# Altium schematic sheet AY Amp.SchDoc
size A3; SheetNumber: 3; SheetTotal: 15
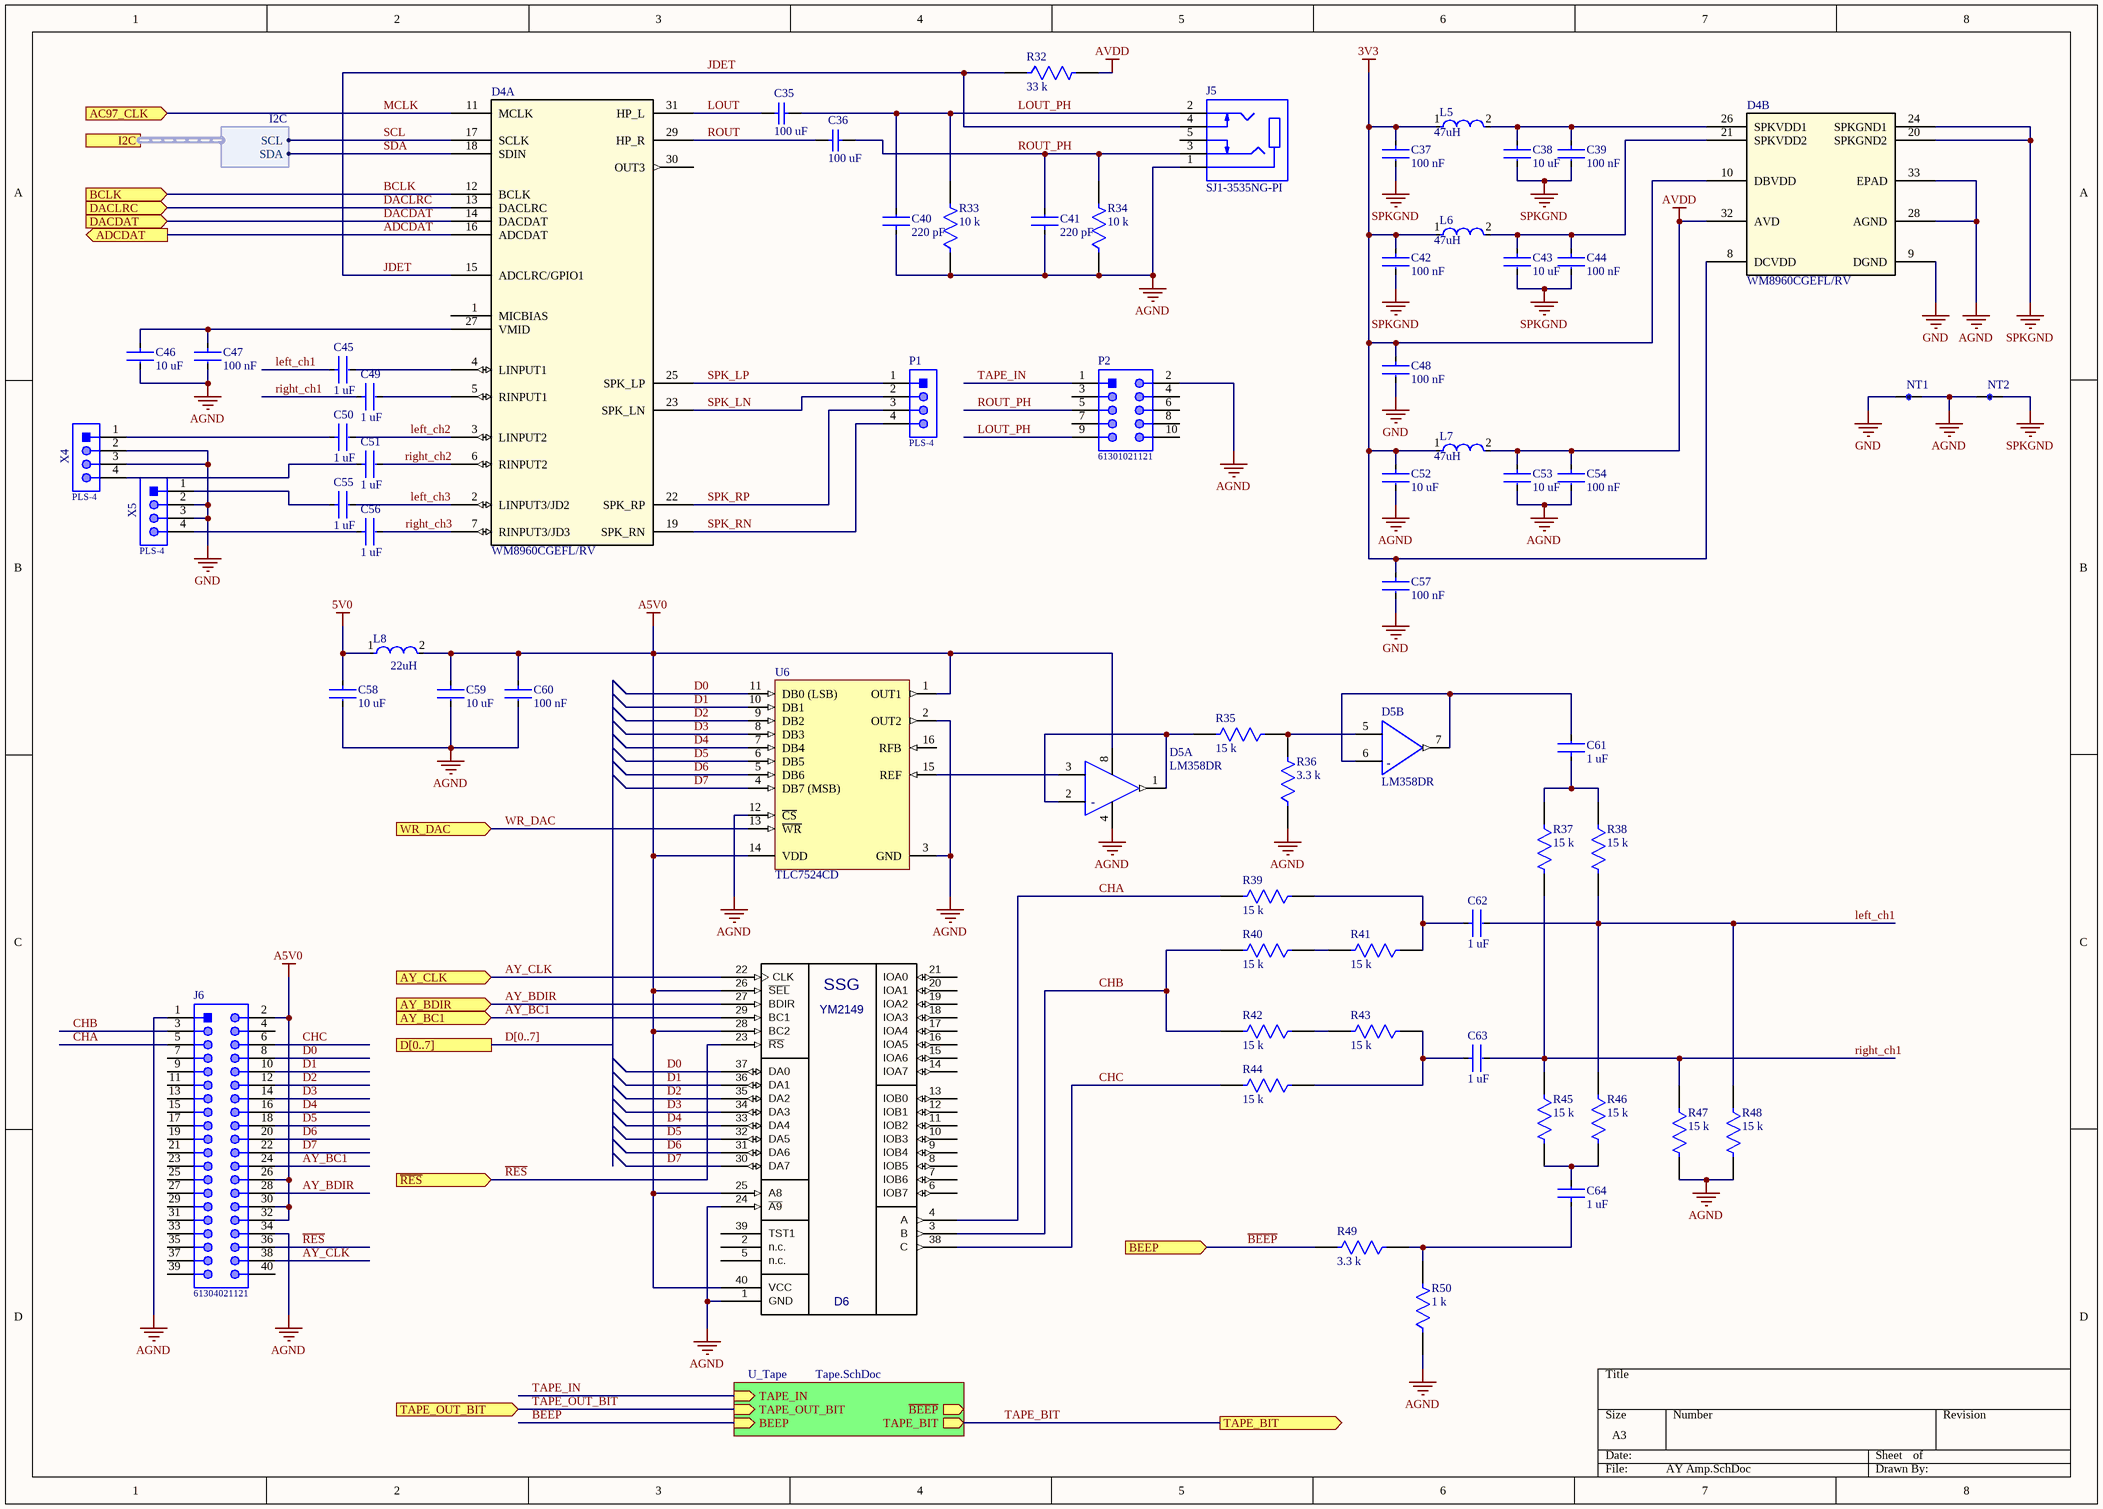
[diagram p0: AY Amp.SchDoc]

## Parts
C35  Capacitance: 100 uF  [CAPC3216X190X55ML30T25]  (hidden comment: CC1206-100uF)
C36  Capacitance: 100 uF  [CAPC3216X190X55ML30T25]  (hidden comment: CC1206-100uF)
C37  Capacitance: 100 nF  [CC0805]  (hidden comment: CC0805-1.5pF)
C38  Capacitance: 10 uF  [CC0805]  (hidden comment: CC0805-1.5pF)
C39  Capacitance: 100 nF  [CC0805]  (hidden comment: CC0805-1.5pF)
C40  Capacitance: 220 pF  [CC0805]  (hidden comment: CC0805-1.5pF)
C41  Capacitance: 220 pF  [CC0805]  (hidden comment: CC0805-1.5pF)
C42  Capacitance: 100 nF  [CC0805]  (hidden comment: CC0805-1.5pF)
C43  Capacitance: 10 uF  [CC0805]  (hidden comment: CC0805-1.5pF)
C44  Capacitance: 100 nF  [CC0805]  (hidden comment: CC0805-1.5pF)
C45  Capacitance: 1 uF  [CC0805]  (hidden comment: CC0805-1.5pF)
C46  Capacitance: 10 uF  [CC0805]  (hidden comment: CC0805-1.5pF)
C47  Capacitance: 100 nF  [CC0805]  (hidden comment: CC0805-1.5pF)
C48  Capacitance: 100 nF  [CC0805]  (hidden comment: CC0805-1.5pF)
C49  Capacitance: 1 uF  [CC0805]  (hidden comment: CC0805-1.5pF)
C50  Capacitance: 1 uF  [CC0805]  (hidden comment: CC0805-1.5pF)
C51  Capacitance: 1 uF  [CC0805]  (hidden comment: CC0805-1.5pF)
C52  Capacitance: 10 uF  [CC0805]  (hidden comment: CC0805-1.5pF)
C53  Capacitance: 10 uF  [CC0805]  (hidden comment: CC0805-1.5pF)
C54  Capacitance: 100 nF  [CC0805]  (hidden comment: CC0805-1.5pF)
C55  Capacitance: 1 uF  [CC0805]  (hidden comment: CC0805-1.5pF)
C56  Capacitance: 1 uF  [CC0805]  (hidden comment: CC0805-1.5pF)
C57  Capacitance: 100 nF  [CC0805]  (hidden comment: CC0805-1.5pF)
C58  Capacitance: 10 uF  [CC0805]  (hidden comment: CC0805-1.5pF)
C59  Capacitance: 10 uF  [CC0805]  (hidden comment: CC0805-1.5pF)
C60  Capacitance: 100 nF  [CC0805]  (hidden comment: CC0805-1.5pF)
C61  Capacitance: 1 uF  [CC0805]  (hidden comment: CC0805-1.5pF)
C62  Capacitance: 1 uF  [CC0805]  (hidden comment: CC0805-1.5pF)
C63  Capacitance: 1 uF  [CC0805]  (hidden comment: CC0805-1.5pF)
C64  Capacitance: 1 uF  [CC0805]  (hidden comment: CC0805-1.5pF)
D4  WM8960CGEFL/RV  [QFN50P500X500X90_HS-33M]  (parts A,B of 2)
D5  LM358DR  [FP-D0008A-MFG]  (parts A,B of 2)
D6  YM2149  [DIP40]
J5  SJ1-3535NG-PI  [CUI_SJ1-3535NG-PI]
J6  61304021121  [61304021121]
L5  Inductance: 47uH  [FP-NR6028-MFG]  (hidden comment: NR6028T470M)
L6  Inductance: 47uH  [FP-NR6028-MFG]  (hidden comment: NR6028T470M)
L7  Inductance: 47uH  [FP-NR6028-MFG]  (hidden comment: NR6028T470M)
L8  Inductance: 22uH  [FP-LQH43CN_03-MFG]  (hidden comment: LQH43CN220K03L)
NT1  net_tie  [NET_TIE]  (value not drawn)  (net tie, no BOM)
NT2  net_tie  [NET_TIE]  (value not drawn)  (net tie, no BOM)
P1  PLS-4  [61300411121]
P2  61301021121  [61301021121]
R32  Resistance: 33 k  [CR0805]  (hidden comment: CR0805-51)
R33  Resistance: 10 k  [CR0805]  (hidden comment: CR0805-51)
R34  Resistance: 10 k  [CR0805]  (hidden comment: CR0805-51)
R35  Resistance: 15 k  [CR0805]  (hidden comment: CR0805-51)
R36  Resistance: 3.3 k  [CR0805]  (hidden comment: CR0805-51)
R37  Resistance: 15 k  [CR0805]  (hidden comment: CR0805-51)
R38  Resistance: 15 k  [CR0805]  (hidden comment: CR0805-51)
R39  Resistance: 15 k  [CR0805]  (hidden comment: CR0805-51)
R40  Resistance: 15 k  [CR0805]  (hidden comment: CR0805-51)
R41  Resistance: 15 k  [CR0805]  (hidden comment: CR0805-51)
R42  Resistance: 15 k  [CR0805]  (hidden comment: CR0805-51)
R43  Resistance: 15 k  [CR0805]  (hidden comment: CR0805-51)
R44  Resistance: 15 k  [CR0805]  (hidden comment: CR0805-51)
R45  Resistance: 15 k  [CR0805]  (hidden comment: CR0805-51)
R46  Resistance: 15 k  [CR0805]  (hidden comment: CR0805-51)
R47  Resistance: 15 k  [CR0805]  (hidden comment: CR0805-51)
R48  Resistance: 15 k  [CR0805]  (hidden comment: CR0805-51)
R49  Resistance: 3.3 k  [CR0805]  (hidden comment: CR0805-51)
R50  Resistance: 1 k  [CR0805]  (hidden comment: CR0805-51)
U6  TLC7524CD  [SO16W]
X4  PLS-4  [61300411121]
X5  PLS-4  [61300411121]

## Sub-sheets
U_Tape = Tape.SchDoc: BEEP (in), TAPE_BIT (out), ~{BEEP} (out), TAPE_OUT_BIT (in), TAPE_IN (in)

## Ports
AC97_CLK (in), ADCDAT (out), AY_BC1 (in), AY_BDIR (in), AY_CLK (in), BCLK (in), BEEP (in), D[0..7], DACDAT (in), DACLRC (in), I2C (harness I2C), TAPE_BIT (out), TAPE_OUT_BIT (in), WR_DAC (in), ~{RES} (in)

## Harnesses
I2C: SDA, SCL

## Nets
3V3: C37.1 C42.1 C48.1 C52.1 C57.1 D4.8(DCVDD) D4.10(DBVDD) L5.1 L6.1 L7.1
5V0: C58.1 L8.1
A5V0: C59.1 C60.1 D5.8(V+) D6.25(A8) D6.26(~{SEL}) D6.28(BC2) D6.40(VCC) J6.2 J6.26 J6.30 J6.32 L8.2 U6.1(OUT1) U6.14(VDD)
AGND: C40.1 C41.1 C46.2 C47.2 C52.2 C53.2 C54.2 C58.2 C59.2 C60.2 D4.28(AGND) D4.33(EPAD) D5.4(V-) D6.1(GND) D6.24(~{A9}) J5.1 J6.1 J6.34 NT1.2 NT2.1 P2.2 R33.1 R34.1 R36.1 R47.2 R48.2 R50.1 U6.2(OUT2) U6.3(GND) U6.12(~{CS})
AVDD: C53.1 C54.1 D4.32(AVD) L7.2 R32.2
GND: C48.2 C57.2 D4.9(DGND) NT1.1 X4.2 X4.3 X5.2 X5.3
SPKGND: C37.2 C38.2 C39.2 C42.2 C43.2 C44.2 D4.20(SPKGND2) D4.24(SPKGND1) NT2.2
ADCDAT: D4.16(ADCDAT) ; port ADCDAT
AY_BC1: D6.29(BC1) J6.24 ; port AY_BC1
AY_BDIR: D6.27(BDIR) J6.28 ; port AY_BDIR
AY_CLK: D6.22(CLK) J6.38 ; port AY_CLK
~{BEEP}: R49.2 ; port BEEP
BCLK: D4.12(BCLK) ; port BCLK
BEEP: sheet U_Tape/BEEP
CHA: D6.4(A) J6.5 R39.2
CHB: D6.3(B) J6.3 R40.2 R42.2
CHC: D6.38(C) J6.6 R44.2
D0: D6.37(DA0) J6.8 U6.11(DB0_(LSB))
D1: D6.36(DA1) J6.10 U6.10(DB1)
D2: D6.35(DA2) J6.12 U6.9(DB2)
D3: D6.34(DA3) J6.14 U6.8(DB3)
D4: D6.33(DA4) J6.16 U6.7(DB4)
D5: D6.32(DA5) J6.18 U6.6(DB5)
D6: D6.31(DA6) J6.20 U6.5(DB6)
D7: D6.30(DA7) J6.22 U6.4(DB7_(MSB))
DACDAT: D4.14(DACDAT) ; port DACDAT
DACLRC: D4.13(DACLRC) ; port DACLRC
JDET: D4.15(ADCLRC/GPIO1) J5.4 R32.1
left_ch1: C45.1 C62.2 R38.2 R46.1 R48.1
left_ch2: C50.2 D4.3(LINPUT2)
left_ch3: C55.2 D4.2(LINPUT3/JD2)
LOUT: C35.1 D4.31(HP_L)
LOUT_PH: C35.2 C40.2 J5.2 P2.9 R33.2
MCLK: D4.11(MCLK) ; port AC97_CLK
~{RES}: D6.23(~{RS}) J6.36 ; port ~{RES}
right_ch1: C49.1 C63.2 R37.2 R45.1 R47.1
right_ch2: C51.2 D4.6(RINPUT2)
right_ch3: C56.2 D4.7(RINPUT3/JD3)
ROUT: C36.1 D4.29(HP_R)
ROUT_PH: C36.2 C41.2 J5.3 P2.5 R34.2
SCL: D4.17(SCLK) ; port I2C.SCL
SDA: D4.18(SDIN) ; port I2C.SDA
SPK_LN: D4.23(SPK_LN) P1.2
SPK_LP: D4.25(SPK_LP) P1.1
SPK_RN: D4.19(SPK_RN) P1.4
SPK_RP: D4.22(SPK_RP) P1.3
TAPE_BIT: port TAPE_BIT, sheet U_Tape/TAPE_BIT
TAPE_IN: P2.1 ; sheet U_Tape/TAPE_IN
TAPE_OUT_BIT: port TAPE_OUT_BIT, sheet U_Tape/TAPE_OUT_BIT
WR_DAC: U6.13(~{WR}) ; port WR_DAC
NetC38_1: C38.1 C39.1 D4.26(SPKVDD1) L5.2
NetC43_1: C43.1 C44.1 D4.21(SPKVDD2) L6.2
NetC45_2: C45.2 D4.4(LINPUT1)
NetC46_1: C46.1 C47.1 D4.27(VMID)
NetC49_2: C49.2 D4.5(RINPUT1)
NetC50_1: C50.1 X4.1
NetC51_1: C51.1 X4.4
NetC55_1: C55.1 X5.1
NetC56_1: C56.1 X5.4
NetC61_1: C61.1 R37.1 R38.1
NetC61_2: C61.2 D5.6(IN2-) D5.7(2OUT)
NetC62_1: C62.1 R39.1 R41.1
NetC63_1: C63.1 R43.1 R44.1
NetC64_1: C64.1 R49.1 R50.2
NetC64_2: C64.2 R45.2 R46.2
NetD5_1: D5.1(1OUT) D5.2(IN1-) R35.2
NetD5_3: D5.3(IN1+) U6.15(REF)
NetD5_5: D5.5(IN2+) R35.1 R36.2
NetR40_1: R40.1 R41.2
NetR42_1: R42.1 R43.2

Not connected (* = marked no-connect by the designer): D4 1(MICBIAS) 30(OUT3); D6 2(n.c.) 5(n.c.) 6(IOB7) 7(IOB6) 8(IOB5) 9(IOB4) 10(IOB3) 11(IOB2) 12(IOB1) 13(IOB0) 14(IOA7) 15(IOA6) 16(IOA5) 17(IOA4) 18(IOA3) 19(IOA2) 20(IOA1) 21(IOA0) 39(TST1); J5 5; J6 4 7 9 11 13 15 17 19 21 23 25 27 29 31 33 35 37 39 40; P2 3 4 6 7 8 10; U6 16(RFB)

## Buses and harness runs
bus D[0..7] = port D[0..7]

## Notes on the sheet
- (in symbol LM358DR, part A) -
- (in symbol LM358DR, part B) -
- (in symbol YM2149) SSG

## Library data of the parts
C35 C36 = CMP-1662-00011-2: Chip Capacitor, 100 uF, +/- 20%, 6.3 V, -55 to 85 degC, 1206 (3216 Metric), RoHS, Tape and Reel; PartNumber: GRM31CR60J107ME39L; Manufacturer: Murata; value: 100 uF; PackageDescription: 2-Pin Surface Mount Device, Body 3.2 x 1.6 mm; Manufacturer Part Number: GRM31CR60J107ME39L; Case/Package: 1206; Category: Cap
C37-C44 C46-C48 C52-C54 C57-C60 = CC0805: CL21 Series 0805 1.5pF 50V ±0.25pF Tolerance C0G Multilayer Ceramic Chip Capacitor; Manufacturer Part Number: CL21C1R5CBANNNC; Manufacturer: Samsung; Category: Cap; value: 1.5pF; Case/Package: 0805
C45 C49-C51 C55 C56 C61-C64 = CC0805: CL21 Series 0805 1.5pF 50V ±0.25pF Tolerance C0G Multilayer Ceramic Chip Capacitor; Manufacturer: Samsung; Manufacturer Part Number: CL21C1R5CBANNNC; Case/Package: 0805; value: 1.5pF; Category: Cap
D4 = WM8960CGEFL/RV: Stereo CODEC with 1W Stereo Class-D speaker Drivers; value: WM8960CGEFL/RV; Case/Package: QNF-32; Category: IC
D5 = LM358DR: IC OPAMP GP 2 CIRCUIT 8SOIC; Manufacturer: Texas Instruments; Case/Package: SOIC; Number of Pins: 8; Manufacturer Part Number: LM358DR; value: LM358DR; Category: IC
J5 = SJ1-3535NG-PI: 3.5 mm Right-Angle Stereo Jack, 5 pin PCB PCB Mount, Isolated Ground, Pink; MF: {'manufacturer': u'CUI'}; Value: *; MP: SJ1-3535NG-PI; Availability: Unavailable; Price: None; Package: None
J6 = CMP-1502-01135-1: THT Vertical Pin Header WR-PHD, Pitch 2.54 mm, Dual Row, 40 pins; Manufacturer: Wurth Elektronik; Contact Resistance: 20mOhm; Pitch: 2.54mm; Pin Number: 40; Withstanding Voltage: 500VAC; Gender: Male; Rated Current: 3A; Working Voltage: 250VAC; Operating Temperature: -40to105degC; Manufacturer URL: http://www.we-online.de; Orientation: Vertical; Datasheet URL: https://katalog.we-online.de/em/datasheet/6130xx21121.pdf; Package Reference: 61304021121; Row Number: Dual; Part Number: 61304021121; Packaging: Bag; Mounting Technology: THT; Publisher: WurthElektronik
L5-L7 = CMP-14484-001222-1: SMD Power Inductors 47uH ±20% 0.92A 0.39Ω; Current Rating: 920mA; Test Frequency: 100kHz; Core Material: Ferrite; Self Resonant Frequency: 8MHz; Shielding: Shielded; DC Resistance (DCR): 390mR; Saturation Current: 950mA; Termination: SMD/SMT; Package Quantity: 2000; RoHS Compliant: Yes; Halogen Free: Halogen Free; Length: 0.236inch; Series: NR; Tolerance: 20%; Width: 0.236inch; Height - Seated (Max): 0.11inch; Number of Pins: 2; Mount: Surface Mount; Min Operating Temperature: -25°C; RMS Current (Irms): 920mA; Packaging: Tape and Reel; Resistor Type: Wirewound; Case/Package: 2424; Inductance Tolerance: 20%; Max Operating Temperature: 120°C; Max DC Current: 920mA; Height: 2.8mm
L8 = CMP-06042-007646-1: Wire Wound Ferrite Inductor for Power Lines 22μH ±10% 0.6Ω 420mA 1812; Manufacturer: Murata; Frequency: 15MHz; Shielding: Unshielded; Test Frequency: 1MHz; DC Resistance (DCR): 600mR; Mount: Surface Mount; Width: 3.2mm; Depth: 3.4mm; Packaging: Tape and Reel; Case Code (Imperial): 1812; DC Current: 420mA; Weight: 0.004586oz; Core Material: Ferrite; Height: 2.6mm; Number of Pins: 2; Min Operating Temperature: -40°C; Max Operating Temperature: 85°C; REACH SVHC: No SVHC; Self Resonant Frequency: 15MHz; Termination: SMD/SMT; Lead Free: Lead Free; Military Standard: Not; Case Code (Metric): 4532; Length: 4.5mm; Radiation Hardening: No; Inductance Tolerance: 10%; Tolerance: 10%; Height - Seated (Max): 0.11inch; Case/Package: 1812; Max DC Current: 420mA; Package Quantity: 500; Resistor Type: Wirewound; Current Rating: 420mA; Manufacturer Part Number: LQH43CN220K03L
P1 X4 X5 = PLS-4: THT Vertical Pin Header WR-PHD, Pitch 2.54 mm, Single Row, 4 pins; Manufacturer: Wurth Electronics; Pitch: 2.54mm; value: header 4 pin 2.54mm; Manufacturer Part Number: 61300411121; Case/Package: PLS-4; Category: Connector
P2 = CMP-1502-01084-1: THT Vertical Pin Header WR-PHD, Pitch 2.54 mm, Dual Row, 10 pins; Manufacturer: Wurth Elektronik; Working Voltage: 250VAC; Pitch: 2.54mm; Contact Resistance: 20mOhm; Gender: Male; Rated Current: 3A; Withstanding Voltage: 500VAC; Pin Number: 10; Operating Temperature: -40to105degC; Mounting Technology: THT; Publisher: WurthElektronik; Manufacturer URL: http://www.we-online.de; Part Number: 61301021121; Row Number: Dual; Packaging: Bag; Orientation: Vertical; Package Reference: 61301021121; Datasheet URL: https://katalog.we-online.de/em/datasheet/6130xx21121.pdf
R32-R34 R50 = CR0805: 51Ω ±0.5% 0.1W 1/10W Chip Resistor 0805 (2012 Metric) Thin Film; Manufacturer: Susumu; Manufacturer Part Number: RR1220Q-510-D; Number of Terminations: 2; Case/Package: 0805; value: 51Ω; Category: Res; Termination: SMD/SMT; Number of Pins: 2
R35-R49 = CR0805: 51Ω ±0.5% 0.1W 1/10W Chip Resistor 0805 (2012 Metric) Thin Film; Manufacturer Part Number: RR1220Q-510-D; Manufacturer: Susumu; Category: Res; value: 51Ω; Case/Package: 0805; Number of Terminations: 2; Termination: SMD/SMT; Number of Pins: 2
U6 = TLC7524CD: 8-Bit, 0.1 us MDAC, Parallel Input, Fast Control Signalling for DSP, Easy Micro Interface, 0 to 70 degC, 16-pin SOIC (D16), Green (RoHS & no Sb/Br); Manufacturer: Texas Instruments; PackageDescription: 16-Pin Plastic Small Outline, Body 9.9 x 3.9 mm, Pitch 1.27 mm; PartNumber: TLC7524CD; Manufacturer Part Number: TLC7524CD; value: TLC7524CD; Case/Package: SOIC-16; Category: IC
D6 = YM2149: Value: YM2149; Case/Package: DIP-40; Category: IC